# Altium schematic sheet PMODE.schdoc: TEBF0808 - MISC
size A4; DocumentNumber: TEBF0808; Revision: 04; SheetNumber: 30; SheetTotal: 36; Date: 2016-09-29; CompanyName: Trenz Electronic GmbH; Organization: Trenz Electronic GmbH
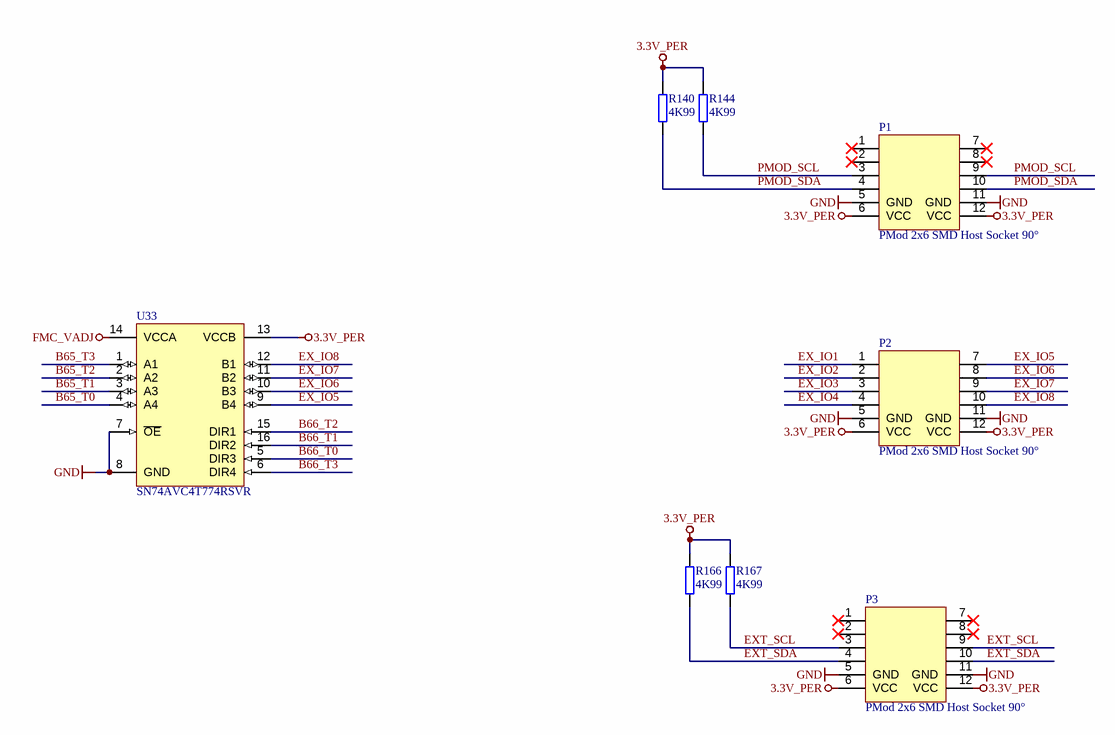
[diagram p0: PMODE.schdoc]

## Parts
P1  PMod 2x6 SMD Host Socket 90°  [610112249221]
P2  PMod 2x6 SMD Host Socket 90°  [610112249221]
P3  PMod 2x6 SMD Host Socket 90°  [610112249221]
R140  4K99  [RESC1005X40N]
R144  4K99  [RESC1005X40N]
R166  4K99  [RESC1005X40N]
R167  4K99  [RESC1005X40N]
U33  SN74AVC4T774RSVR  [QFN40P260X180X55-16N]

## Nets
3.3V_PER: P1.6(VCC) P1.12(VCC) P2.6(VCC) P2.12(VCC) P3.6(VCC) P3.12(VCC) R140.1 R144.1 R166.1 R167.1 U33.13(VCCB)
FMC_VADJ: U33.14(VCCA)
GND: P1.5(GND) P1.11(GND) P2.5(GND) P2.11(GND) P3.5(GND) P3.11(GND) U33.7(~{OE}) U33.8(GND)
B65_T0: U33.4(A4)
B65_T1: U33.3(A3)
B65_T2: U33.2(A2)
B65_T3: U33.1(A1)
B66_T0: U33.5(DIR3)
B66_T1: U33.16(DIR2)
B66_T2: U33.15(DIR1)
B66_T3: U33.6(DIR4)
EX_IO1: P2.1
EX_IO2: P2.2
EX_IO3: P2.3
EX_IO4: P2.4
EX_IO5: P2.7 U33.9(B4)
EX_IO6: P2.8 U33.10(B3)
EX_IO7: P2.9 U33.11(B2)
EX_IO8: P2.10 U33.12(B1)
EXT_SCL: P3.3 P3.9 R167.2
EXT_SDA: P3.4 P3.10 R166.2
PMOD_SCL: P1.3 P1.9 R144.2
PMOD_SDA: P1.4 P1.10 R140.2

Not connected (* = marked no-connect by the designer): P1 1* 2* 7* 8*; P3 1* 2* 7* 8*

## Notes on the sheet
- Title:
- Number:
- Rev.
- Date:
- A4
- Copyright:
- Page
- of
- Filename:

## Library data of the parts
P1-P3 = 27149: PMod 2x6 SMD Socket 90°; AN: 27149; Mixed: SMT; Trenz-Stock: Yes; HelpURL: B:\ad\adlib\datasheet\610112249221; H-ART: 610112249221
R140 R144 R166 R167 = 22754: WID SMD 4K99 1% 0,063W; AN: 22754; Value: 4.99K; Mixed: SMT; Preferred: Yes; Case: 1005 (0402); Tolerance: 1%; Technology: TK100
U33 = 27170: AN: 27170; Mixed: SMT; Trenz-Stock: Yes; Case: UQFN-16; HelpURL: B:\ad\adlib\datasheet\sn74avc4t774; H-ART: SN74AVC4T774RSVR